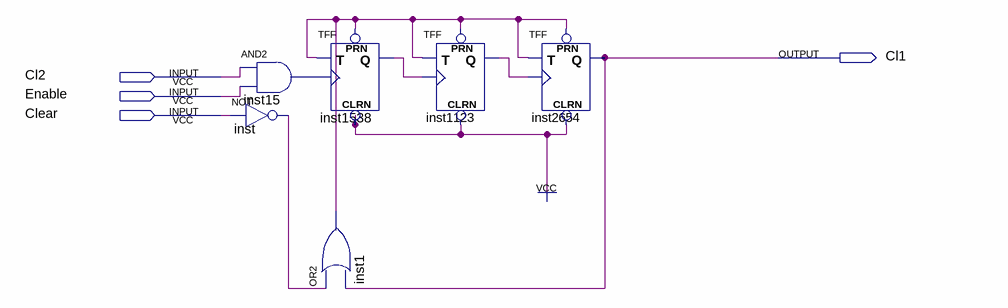
[diagram p0: schematic sheet]
// Quartus schematic clock1_8.bdf as structural Verilog: 6 symbols, 4 pins
module clock1_8 (
  input  Cl2,
  input  Enable,
  input  Clear,
  output Cl1
);

  wire inst1_out, inst15_out, inst1123_q, inst1538_q, inst_out;

  not inst (inst_out, Clear);
  and inst15 (inst15_out, Cl2, Enable);
  or inst1 (inst1_out, inst_out, Cl1);
  TFF inst1538 (.PRN(inst1_out), .CLRN(1'b1), .T(inst1_out), .CLK(inst15_out), .Q(inst1538_q));
  TFF inst1123 (.PRN(inst1_out), .CLRN(1'b1), .T(inst1_out), .CLK(inst1538_q), .Q(inst1123_q));
  TFF inst2654 (.PRN(inst1_out), .CLRN(1'b1), .T(inst1_out), .CLK(inst1123_q), .Q(Cl1));
endmodule
